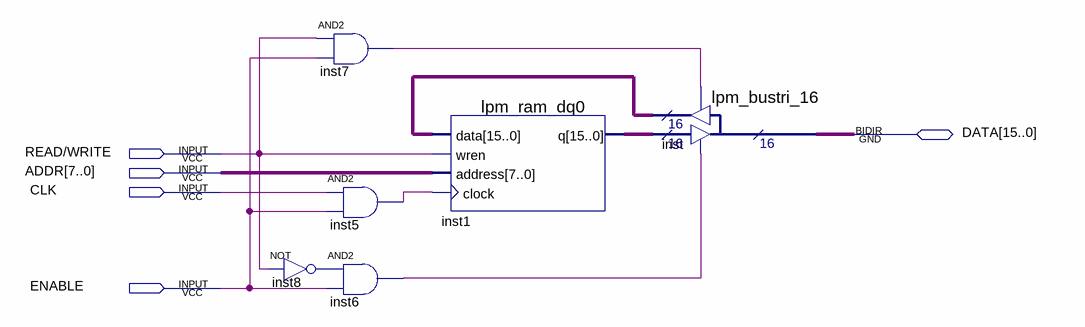
[diagram p0: schematic sheet]
// Quartus schematic memory_ram.bdf as structural Verilog: 6 symbols, 5 pins
module memory_ram (
  input  \READ/WRITE ,
  input  [7:0] ADDR,
  input  CLK,
  input  ENABLE,
  inout  [15:0] DATA
);

  wire inst5_out, inst6_out, inst7_out, inst8_out;
  wire [15:0] inst1_q, inst_result;

  and inst7 (inst7_out, \READ/WRITE , ENABLE);
  and inst5 (inst5_out, CLK, ENABLE);
  and inst6 (inst6_out, inst8_out, ENABLE);
  not inst8 (inst8_out, \READ/WRITE );
  lpm_ram_dq0 inst1 (.data(inst_result), .wren(\READ/WRITE ), .address(ADDR), .clock(inst5_out), .q(inst1_q));
  lpm_bustri_16 inst (.enabledt(inst6_out), .data(inst1_q), .enabletr(inst7_out), .result(inst_result), .tridata(DATA));
endmodule
